# EasyEDA Pro project DA15.epro, schematic DA15

## Sheets
1 Controller: Board Name: DA15_H5_4_LAYERS; Create Date: 2026-02-15; Page Name: Controller; Project Name: dac-amp; Schematic Name: DA15_2; Update Date: 2026-02-26; Company: EasyEDA.com; Page Size: A4; Version: V1.0
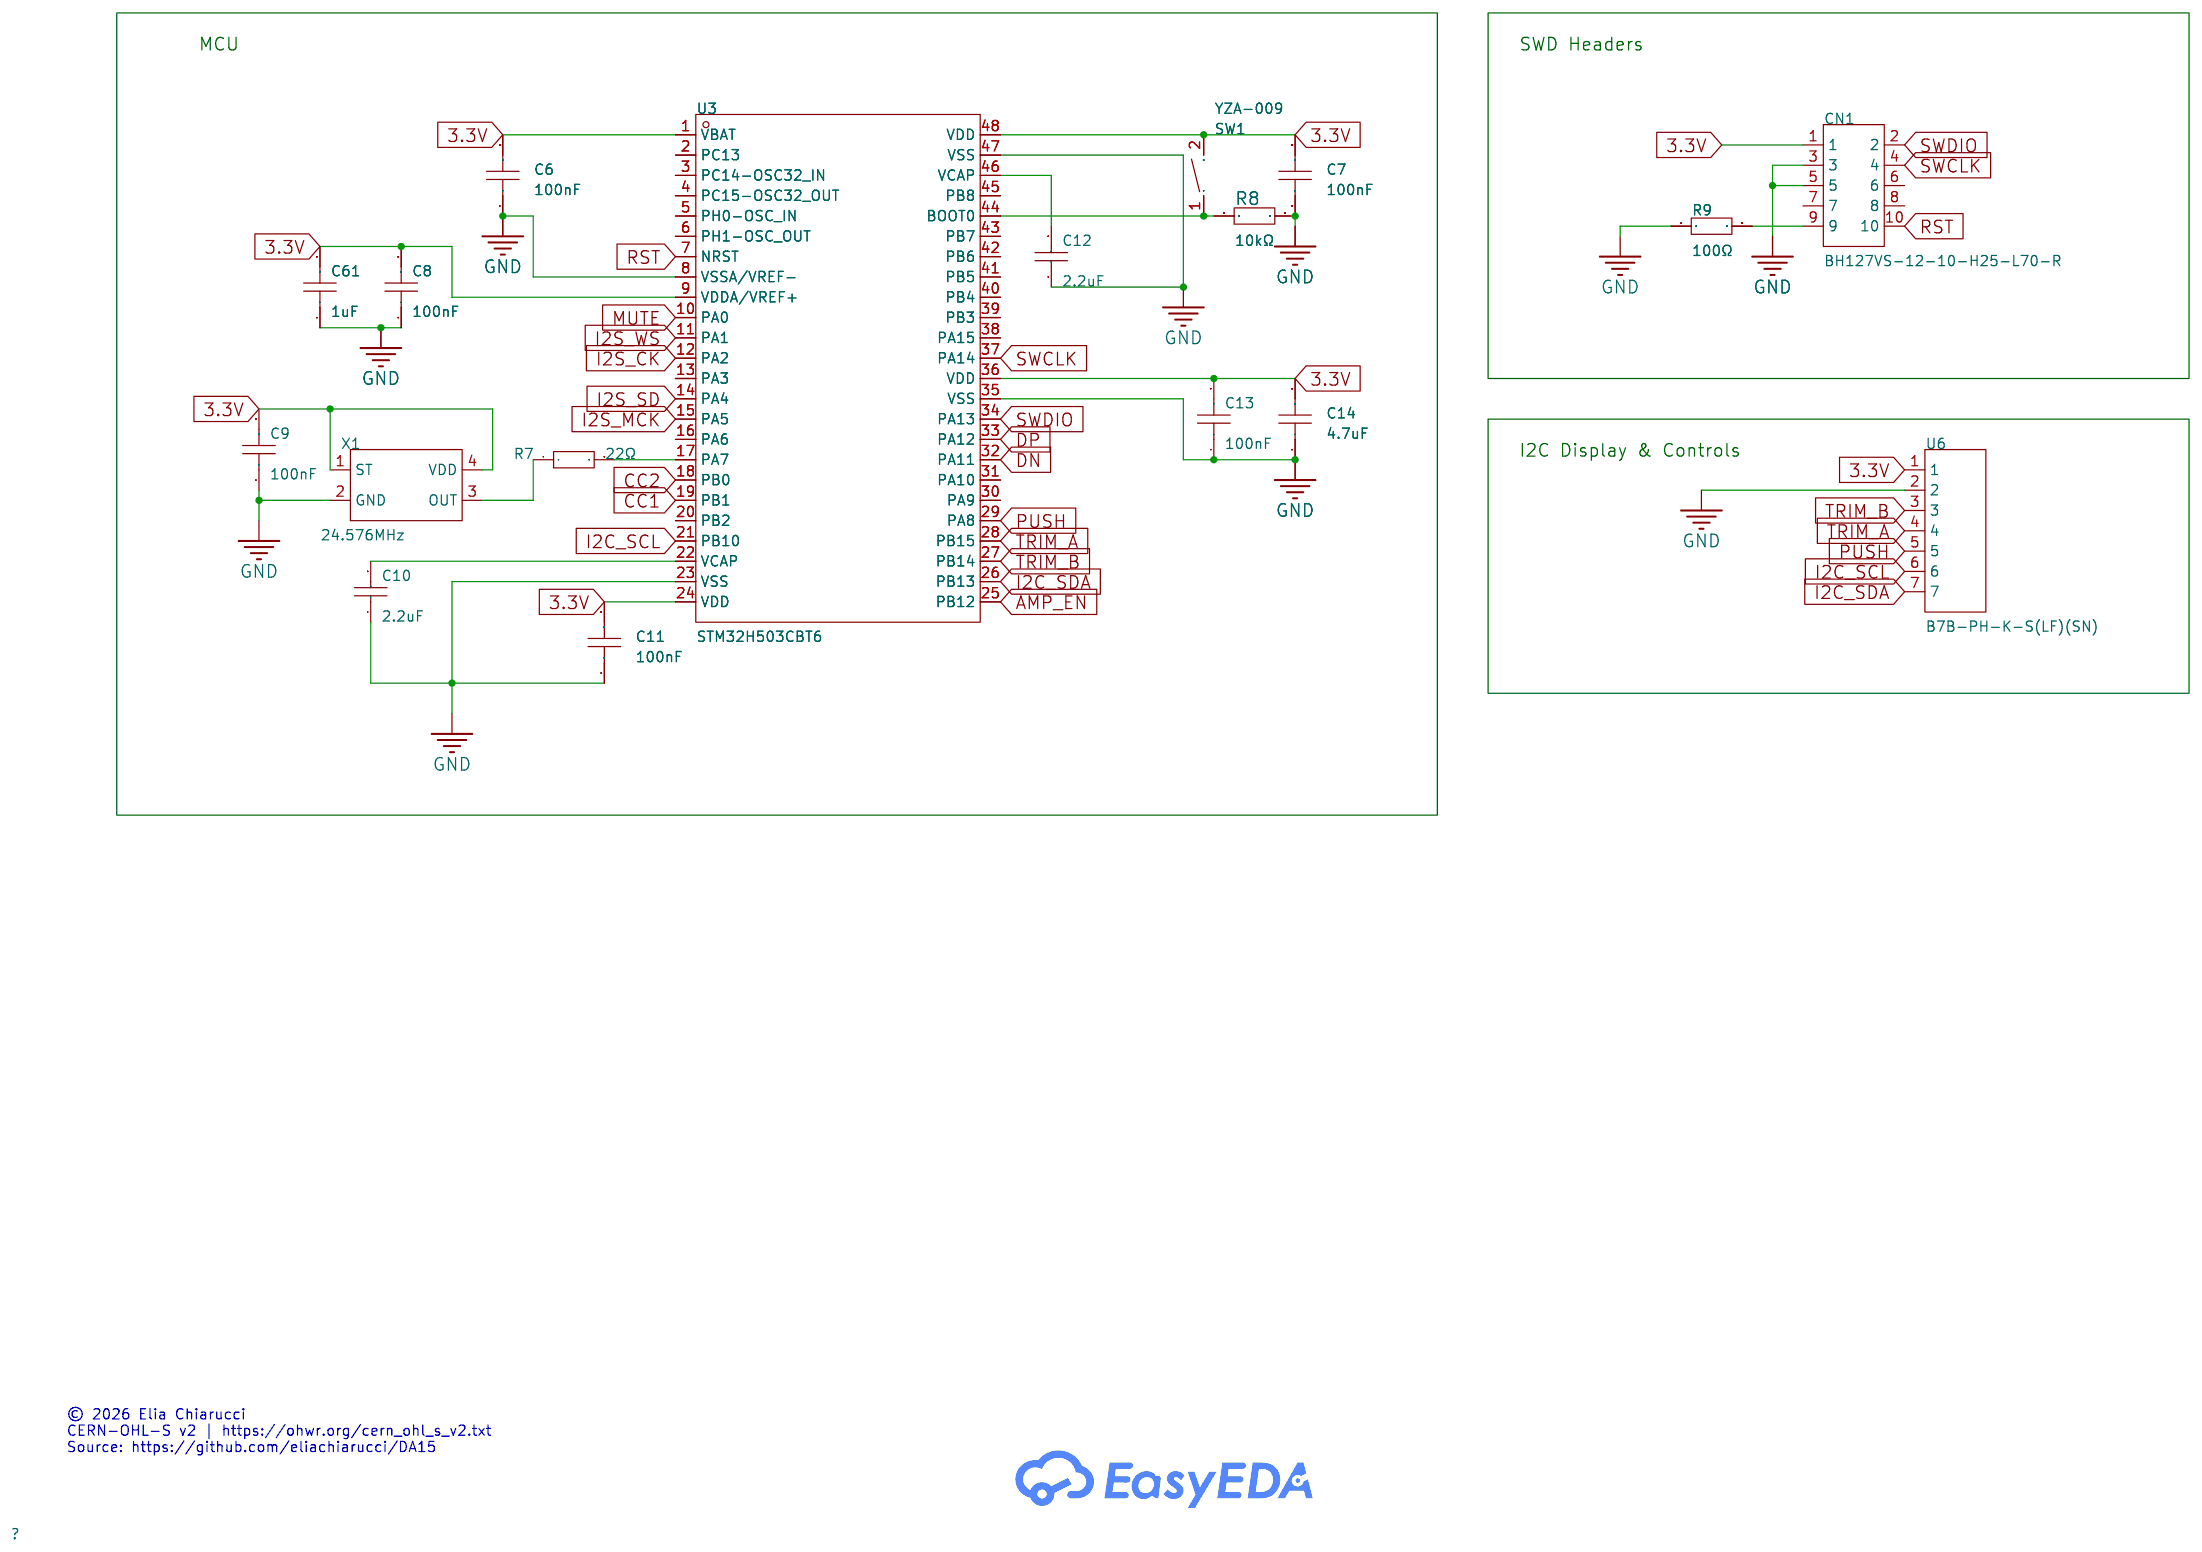
[diagram p0: Controller]
2 Power: Board Name: DA15_1; Create Date: 2026-02-10; Page Name: Power; Schematic Name: DA15_1; Update Date: 2026-02-11
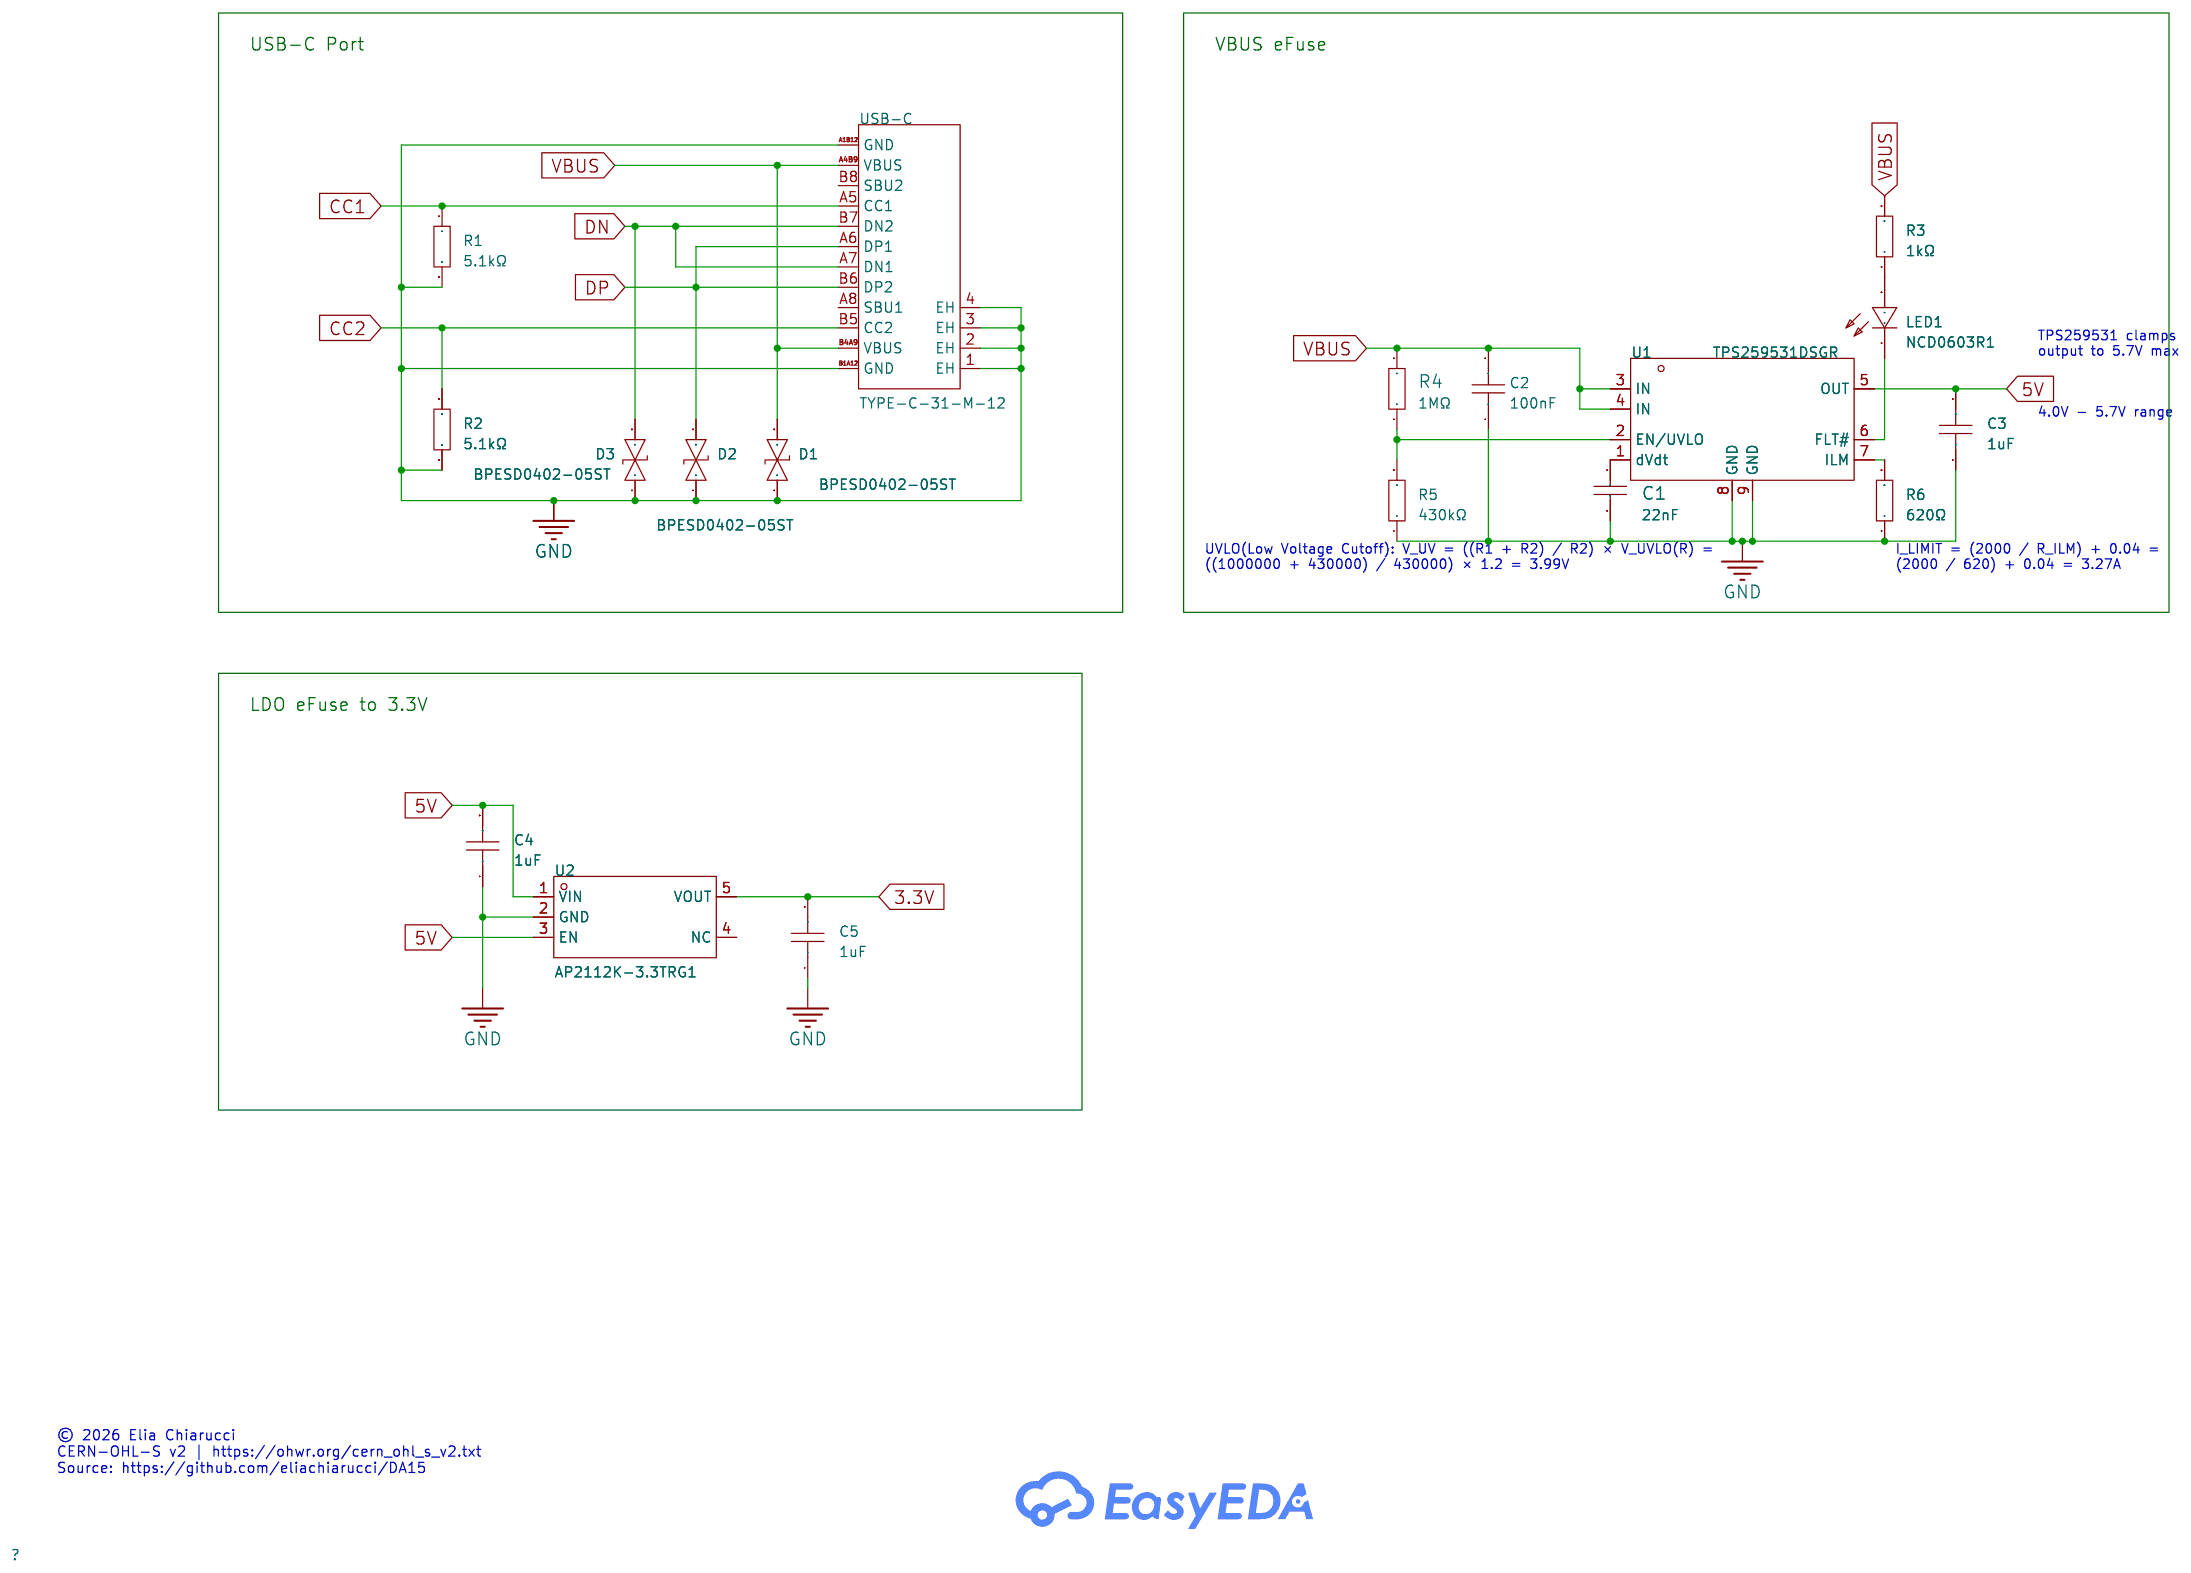
[diagram p1: Power]
3 Audio: Page Name: Audio
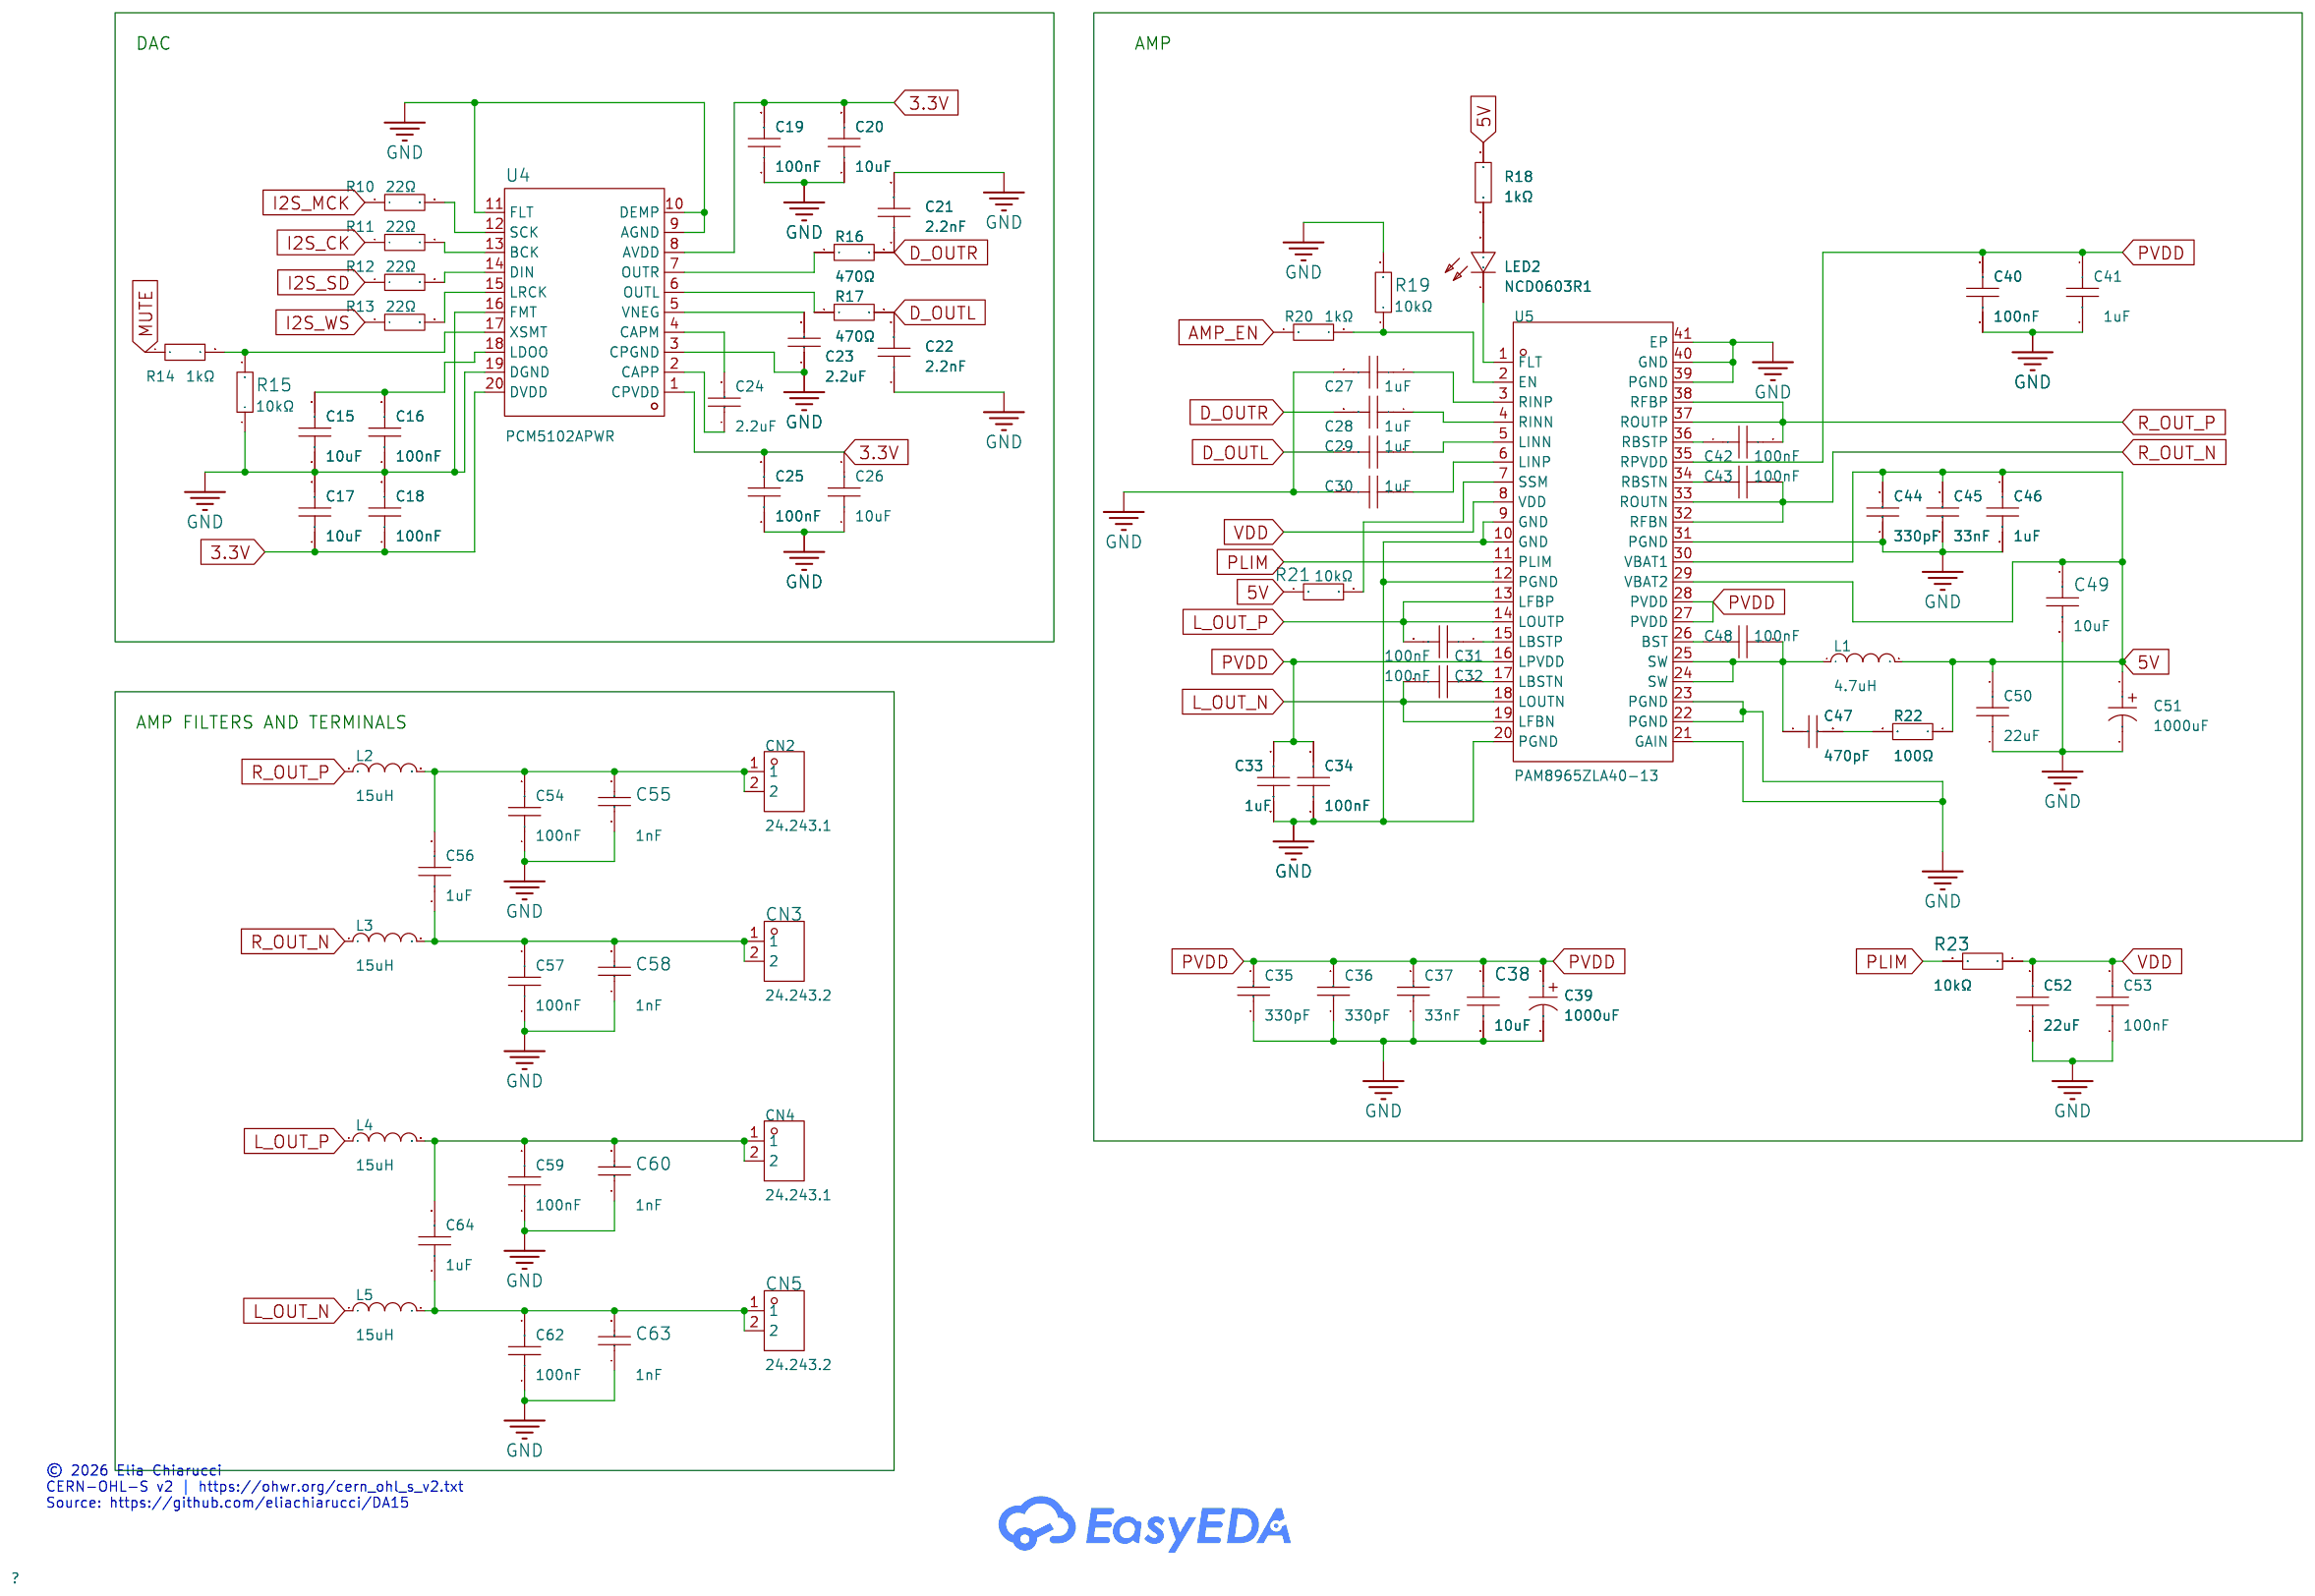
[diagram p2: Audio]

## Parts
sheet Audio
C15  10uF  [C0603]
C16  100nF  [C0603]
C17  10uF  [C0603]
C18  100nF  [C0603]
C19  100nF  [C0603]
C20  10uF  [C0603]
C21  2.2nF  [C0603]
C22  2.2nF  [C0603]
C23  2.2uF  [C0603]
C24  2.2uF  [C0603]
C25  100nF  [C0603]
C26  10uF  [C0603]
C27  1uF  [C0603]
C28  1uF  [C0603]
C29  1uF  [C0603]
C30  1uF  [C0603]
C31  100nF  [C0603]
C32  100nF  [C0603]
C33  1uF  [C0603]
C34  100nF  [C0603]
C35  330pF  [C0603]
C36  330pF  [C0603]
C37  33nF  [C0603]
C38  10uF  [C0603]
C39  1000uF  [CAP-TH_BD8.0-P3.50-D0.6-FD]
C40  100nF  [C0603]
C41  1uF  [C0603]
C42  100nF  [C0603]
C43  100nF  [C0603]
C44  330pF  [C0603]
C45  33nF  [C0603]
C46  1uF  [C0603]
C47  470pF  [C0603]
C48  100nF  [C0603]
C49  10uF  [C0603]
C50  22uF  [C0603]
C51  1000uF  [CAP-TH_BD8.0-P3.50-D0.6-FD]
C52  22uF  [C0603]
C53  100nF  [C0603]
C54  100nF  [C0603]
C55  1nF  [C0603]
C56  1uF  [C0603]
C57  100nF  [C0603]
C58  1nF  [C0603]
C59  100nF  [C0603]
C60  1nF  [C0603]
C62  100nF  [C0603]
C63  1nF  [C0603]
C64  1uF  [C0603]
CN2  24.243.1  [CONN-TH_24.243.1_RED]
CN3  24.243.2  [CONN-TH_24.243.2]
CN4  24.243.1  [CONN-TH_24.243.1_RED]
CN5  24.243.2  [CONN-TH_24.243.2]
L1  4.7uH  [IND-SMD_L7.3-W6.6_MHCI06030]
L2  15uH  [IND-SMD_L11.6-W10.1]
L3  15uH  [IND-SMD_L11.6-W10.1]
L4  15uH  [IND-SMD_L11.6-W10.1]
L5  15uH  [IND-SMD_L11.6-W10.1]
LED2  NCD0603R1  [LED0603-RD_RED]
R10  22Ω  [R0603]
R11  22Ω  [R0603]
R12  22Ω  [R0603]
R13  22Ω  [R0603]
R14  1kΩ  [R0603]
R15  10kΩ  [R0603]
R16  470Ω  [R0603]
R17  470Ω  [R0603]
R18  1kΩ  [R0603]
R19  10kΩ  [R0603]
R20  1kΩ  [R0603]
R21  10kΩ  [R0603]
R22  100Ω  [R0603]
R23  10kΩ  [R0603]
U4  PCM5102APWR  [TSSOP-20_L6.5-W4.4-P0.65-LS6.4-BL]
U5  PAM8965ZLA40-13  [WQFN-40_L5.0-W5.0-P0.40-TL-EP3.5]
sheet Controller
C6  100nF  [C0603]
C7  100nF  [C0603]
C8  100nF  [C0603]
C9  100nF  [C0603]
C10  2.2uF  [C0603]
C11  100nF  [C0603]
C12  2.2uF  [C0603]
C13  100nF  [C0603]
C14  4.7uF  [C0603]
C61  1uF  [C0603]
CN1  BH127VS-12-10-H25-L70-R  [CONN-SMD_10P-P1.27-V-M-R2-C5-LS5.8_BH127VS-12-10-H25-L70-R]
R7  22Ω  [R0603]
R8  10kΩ  [R0603]
R9  100Ω  [R0603]
SW1  YZA-009  [SW-SMD_YZA-009]
U3  STM32H503CBT6  [LQFP-48_L7.0-W7.0-P0.50-LS9.0-BL]
U6  B7B-PH-K-S(LF)(SN)  [CONN-TH_B7B-PH-K-S-LF-SN]
X1  24.576MHz  [OSC-SMD_4P-L2.5-W2.0-BL]
sheet Power
C1  22nF  [C0603]
C2  100nF  [C0603]
C3  1uF  [C0603]
C4  1uF  [C0603]
C5  1uF  [C0603]
D1  BPESD0402-05ST  [D0402-BI]
D2  BPESD0402-05ST  [D0402-BI]
D3  BPESD0402-05ST  [D0402-BI]
LED1  NCD0603R1  [LED0603-RD_RED]
R1  5.1kΩ  [R0603]
R2  5.1kΩ  [R0603]
R3  1kΩ  [R0603]
R4  1MΩ  [R0603]
R5  430kΩ  [R0603]
R6  620Ω  [R0603]
U1  TPS259531DSGR  [WSON-8_L2.0-W2.0-P0.50-TL-EP]
U2  AP2112K-3.3TRG1  [SOT-25-5_L2.9-W1.6-P0.95-LS2.8-BL]
USB-C  TYPE-C-31-M-12  [USB-C_SMD-TYPE-C-31-M-12_1]

## Library data of the parts
C15 C17 C20 C26 = CL10A106KP8NNNC: Capacitance:10uF Tolerance:±10% Tolerance:±10% Voltage Rating:10V Temperature Coefficient:X5R; LCSC Part Name: 10uF ±10% 10V; Supplier Part: C19702; Manufacturer: SAMSUNG(三星); Supplier Footprint: 0603; JLCPCB Part Class: Basic Part; Datasheet: https://item.szlcsc.com/datasheet/CL10A106KP8NNNC/20411.html; Supplier: LCSC; Tolerance: ±10%; Voltage Rating: 10V; Temperature Coefficient: X5R
C2 C6-C9 C11 C13 C16 C18 C19 C25 C31 C32 C34 C40 C42 C43 C48 C53 C54 C57 C59 C62 = CC0603KRX7R9BB104: Capacitance:100nF Tolerance:±10% Tolerance:±10% Voltage Rating:50V Temperature Coefficient:X7R; LCSC Part Name: 100nF ±10% 50V; Supplier Part: C14663; Manufacturer: YAGEO(国巨); Supplier Footprint: 0603; JLCPCB Part Class: Basic Part; Datasheet: https://item.szlcsc.com/datasheet/CC0603KRX7R9BB104/15331.html; Supplier: LCSC; Tolerance: ±10%; Voltage Rating: 50V; Temperature Coefficient: X7R
C21 C22 = GCM1885C1H222FA16D: Capacitance: Tolerance:±1% Tolerance:±1% Voltage Rated:50V Temperature Coefficient:; LCSC Part Name: 2.2nF ±1% 50V; Supplier Part: C882578; Manufacturer: muRata(村田); Supplier Footprint: 0603; JLCPCB Part Class: Extended Part; Datasheet: https://atta.szlcsc.com/upload/public/pdf/source/20201228/C882578_EDF992AD6064A2D085B371C371799E69.pdf; Supplier: LCSC; Tolerance: ±1%; Voltage Rated: 50V
C10 C12 C23 C24 = CL10A225KO8NNNC: Capacitance:2.2uF Tolerance:±10% Tolerance:±10% Voltage Rating:16V Temperature Coefficient:X5R; LCSC Part Name: 2.2uF ±10% 16V; Supplier Part: C23630; Manufacturer: SAMSUNG(三星); Supplier Footprint: 0603; JLCPCB Part Class: Basic Part; Datasheet: https://item.szlcsc.com/datasheet/CL10A225KO8NNNC/24366.html; Supplier: LCSC; Tolerance: ±10%; Voltage Rating: 16V; Temperature Coefficient: X5R
C3-C5 C27-C30 C33 C41 C46 C56 C61 C64 = CL10A105KB8NNNC: Capacitance:1uF Tolerance:±10% Tolerance:±10% Voltage Rating:50V Temperature Coefficient:X5R; LCSC Part Name: 1uF ±10% 50V; Supplier Part: C15849; Manufacturer: SAMSUNG(三星); Supplier Footprint: 0603; JLCPCB Part Class: Basic Part; Datasheet: https://item.szlcsc.com/datasheet/CL10A105KB8NNNC/16531.html; Supplier: LCSC; Tolerance: ±10%; Voltage Rating: 50V; Temperature Coefficient: X5R
C35 C36 C44 = CL10C331JB8NNNC: Capacitance:330pF Tolerance:±5% Tolerance:±5% Voltage Rating:50V Temperature Coefficient:C0G; LCSC Part Name: 330pF ±5% 50V; Supplier Part: C1664; Manufacturer: SAMSUNG(三星); Supplier Footprint: 0603; JLCPCB Part Class: Basic Part; Datasheet: https://item.szlcsc.com/datasheet/CL10C331JB8NNNC/2016.html; Supplier: LCSC; Tolerance: ±5%; Voltage Rating: 50V; Temperature Coefficient: C0G
C37 C45 = CL10B333KB8NNNC: Capacitance:33nF Tolerance:±10% Tolerance:±10% Voltage Rating:50V Temperature Coefficient:X7R; LCSC Part Name: 33nF ±10% 50V; Supplier Part: C21117; Manufacturer: SAMSUNG(三星); Supplier Footprint: 0603; JLCPCB Part Class: Basic Part; Datasheet: https://item.szlcsc.com/datasheet/CL10B333KB8NNNC/21829.html; Supplier: LCSC; Tolerance: ±10%; Voltage Rating: 50V; Temperature Coefficient: X7R
C38 C49 = GRM188R61E106KA73D: Capacitance:10uF Tolerance:±10% Tolerance:±10% Voltage Rating:25V Temperature Coefficient:X5R; LCSC Part Name: 10uF ±10% 25V; Supplier Part: C344022; Manufacturer: muRata(村田); Supplier Footprint: 0603; JLCPCB Part Class: Extended Part; Datasheet: https://item.szlcsc.com/datasheet/GRM188R61E106KA73D/320824.html; Supplier: LCSC; Tolerance: ±10%; Voltage Rating: 25V; Temperature Coefficient: X5R
C39 C51 = PA25V1000M8X15: Capacitance:1000uF Tolerance:±20% Tolerance:±20% Voltage Rating:25V Ripple Current:4.1A@100kHz Equivalent Series Resistance(ESR):16mΩ@100kHz Type:Polymer Diameter:8mm Height - Seated (Max):15mm Lifetime:2000hrs@105℃ Operating Temperature:-55℃~+105℃ Operat; LCSC Part Name: 1000uF ±20% 25V; Supplier Part: C48935375; Manufacturer: JIERR(捷而瑞); Supplier Footprint: 插件,D8xL15mm; JLCPCB Part Class: Extended Part; Datasheet: https://item.szlcsc.com/datasheet/PA25V1000M8X15/51248495.html; Supplier: LCSC; Tolerance: ±20%; Voltage Rating: 25V; Ripple Current: 4.1A@100kHz; Equivalent Series Resistance(ESR): 16mΩ@100kHz; Type: Polymer; Diameter: 8mm; Height - Seated (Max): 15mm; Lifetime: 2000hrs@105℃; Operating Temperature: -55℃~+105℃
C47 = 0603B471K500NT: Capacitance:470pF Tolerance:±10% Tolerance:±10% Voltage Rating:50V Temperature Coefficient:X7R; LCSC Part Name: 470pF ±10% 50V; Supplier Part: C1620; Manufacturer: FH(风华); Supplier Footprint: 0603; JLCPCB Part Class: Basic Part; Datasheet: https://item.szlcsc.com/datasheet/0603B471K500NT/1972.html; Supplier: LCSC; Tolerance: ±10%; Voltage Rating: 50V; Temperature Coefficient: X7R
C50 C52 = GRM188C61E226ME01D: Capacitance:22uF Tolerance:±20% Tolerance:±20% Voltage Rating:25V; LCSC Part Name: 22uF ±20% 25V; Supplier Part: C29519229; Manufacturer: muRata(村田); Supplier Footprint: 0603; JLCPCB Part Class: Extended Part; Datasheet: https://item.szlcsc.com/datasheet/GRM188C61E226ME01D/31245821.html; Supplier: LCSC; Tolerance: ±20%; Voltage Rating: 25V
C55 C58 C60 C63 = CL10B102KB8NNNC: Capacitance:1nF Tolerance:±10% Tolerance:±10% Voltage Rating:50V Temperature Coefficient:X7R; LCSC Part Name: 1nF ±10% 50V; Supplier Part: C1588; Manufacturer: SAMSUNG(三星); Supplier Footprint: 0603; JLCPCB Part Class: Basic Part; Datasheet: https://item.szlcsc.com/datasheet/CL10B102KB8NNNC/1940.html; Supplier: LCSC; Tolerance: ±10%; Voltage Rating: 50V; Temperature Coefficient: X7R
CN2 CN4 = 24.243.1: Connector Type:Terminal Voltage Rating:60V Current Rating:24A; LCSC Part Name: 接线柱; Supplier Part: C7437321; Manufacturer: AMASS(艾迈斯); Supplier Footprint: 插件; JLCPCB Part Class: Extended Part; Datasheet: https://item.szlcsc.com/datasheet/24.243.1/8459546.html; Supplier: LCSC; Connector Type: Terminal; Voltage Rating: 60V; Current Rating: 24A
CN3 CN5 = 24.243.2: Connector Type:Terminal Voltage Rating:60V Current Rating:24A; LCSC Part Name: 接线柱; Supplier Part: C7437322; Manufacturer: AMASS(艾迈斯); Supplier Footprint: 插件; JLCPCB Part Class: Extended Part; Datasheet: https://item.szlcsc.com/datasheet/24.243.2/8459547.html; Supplier: LCSC; Connector Type: Terminal; Voltage Rating: 60V; Current Rating: 24A
L1 = SRP7028A-4R7M: Inductance:4.7uH Tolerance:±20% Tolerance:±20% Current Rating:5.5A Current - Saturation(Isat):10A DC Resistance(DCR):37mΩ Type:- Ratings:AEC-Q200; LCSC Part Name: 4.7uH ±20% 10A; Supplier Part: C840529; Manufacturer: BOURNS; Supplier Footprint: SMD,7.3x6.6mm; JLCPCB Part Class: Extended Part; Datasheet: https://item.szlcsc.com/datasheet/SRP7028A-4R7M/897031.html; Supplier: LCSC; Tolerance: ±20%; Current Rating: 5.5A; Current - Saturation(Isat): 10A; DC Resistance(DCR): 37mΩ; Ratings: AEC-Q200
L2-L5 = CYA1040-15UH: Inductance: Tolerance:±20% Tolerance:±20% Rated Current:6.25A Saturation Current (Isat): DC Resistance (DCR):; LCSC Part Name: 15uH ±20% 6A; Supplier Part: C6364678; Manufacturer: SHOU HAN(首韩); Supplier Footprint: SMD,11.6x10.1mm; JLCPCB Part Class: Extended Part; Datasheet: https://atta.szlcsc.com/upload/public/pdf/source/20230523/79E0199319BE6C9C9D22935DF2949D18.pdf; Supplier: LCSC; Tolerance: ±20%; Rated Current: 6.25A
LED1 LED2 = NCD0603R1_C84263: Lamp Holder Type:- Illumination Color:Red Voltage - Forward(Vf):1.6V~2.6V Voltage - Forward(Vf):1.6V~2.6V Power(Watts):65mW Forward Current:25mA Wavelength - Dominant:615nm~630nm Wavelength - Dominant:615nm~630nm Peak Wavelength:630nm Diode Configuration:; LCSC Part Name: 片式发光二极管; Supplier Part: C84263; Manufacturer: 国星光电; Supplier Footprint: 0603; JLCPCB Part Class: Extended Part; Datasheet: https://item.szlcsc.com/datasheet/NCD0603R1/85432.html; Supplier: LCSC; Illumination Color: Red; Voltage - Forward(Vf): 1.6V~2.6V; Power(Watts): 65mW; Forward Current: 25mA; Wavelength - Dominant: 615nm~630nm; Peak Wavelength: 630nm; Diode Configuration: Discrete Diode; Luminous Intensity: 220mcd; Viewing Angle: 130°; Operating Temperature: -30℃~+85℃
R7 R10-R13 = 0603WAF220JT5E: Type:Thick Film Resistors Resistance:22Ω Tolerance:±1% Tolerance:±1% Power(Watts): Overload Voltage (Max): Temperature Coefficient:±100ppm/℃ Temperature Coefficient:±100ppm/℃ Operating Temperature Range:-55℃~+155℃ Operating Temperature Range:-55℃~+155℃; LCSC Part Name: 22Ω ±1% 100mW 厚膜电阻; Supplier Part: C23345; Manufacturer: UNI-ROYAL(厚声); Supplier Footprint: 0603; JLCPCB Part Class: Basic Part; Datasheet: https://atta.szlcsc.com/upload/public/pdf/source/20200306/C422600_1E6D84923E4A46A82E41ADD87F860B5C.pdf; Supplier: LCSC; Type: Thick Film Resistors; Tolerance: ±1%; Temperature Coefficient: ±100ppm/℃; Operating Temperature Range: -55℃~+155℃
R3 R14 R18 R20 = 0603WAF1001T5E: Type:Thick Film Resistor Resistance:1kΩ Tolerance:±1% Tolerance:±1% Power(Watts):100mW Voltage-Supply(Max):75V Temperature Coefficient:±100ppm/℃ Temperature Coefficient:±100ppm/℃ Operating Temperature:-55℃~+155℃ Operating Temperature:-55℃~+155℃; LCSC Part Name: 1kΩ ±1% 100mW 厚膜电阻; Supplier Part: C21190; Manufacturer: UNI-ROYAL(厚声); Supplier Footprint: 0603; JLCPCB Part Class: Basic Part; Datasheet: https://item.szlcsc.com/datasheet/0603WAF1001T5E/21904.html; Supplier: LCSC; Type: Thick Film Resistor; Tolerance: ±1%; Power(Watts): 100mW; Voltage-Supply(Max): 75V; Temperature Coefficient: ±100ppm/℃; Operating Temperature: -55℃~+155℃
R8 R15 R19 R21 R23 = 0603WAF1002T5E: Type:Thick Film Resistor Resistance:10kΩ Tolerance:±1% Tolerance:±1% Power(Watts):100mW Voltage-Supply(Max):75V Temperature Coefficient:±100ppm/℃ Temperature Coefficient:±100ppm/℃ Operating Temperature:-55℃~+155℃ Operating Temperature:-55℃~+155℃; LCSC Part Name: 厚膜电阻 10kΩ ±1% 100mW; Supplier Part: C25804; Manufacturer: UNI-ROYAL(厚声); Supplier Footprint: 0603; JLCPCB Part Class: Basic Part; Datasheet: https://item.szlcsc.com/datasheet/0603WAF1002T5E/26547.html; Supplier: LCSC; Type: Thick Film Resistor; Tolerance: ±1%; Power(Watts): 100mW; Voltage-Supply(Max): 75V; Temperature Coefficient: ±100ppm/℃; Operating Temperature: -55℃~+155℃
R16 R17 = 0603WAF4700T5E: Type:Thick Film Resistor Resistance:470Ω Tolerance:±1% Tolerance:±1% Power(Watts):100mW Voltage-Supply(Max):75V Temperature Coefficient:±100ppm/℃ Temperature Coefficient:±100ppm/℃ Operating Temperature:-55℃~+155℃ Operating Temperature:-55℃~+155℃; LCSC Part Name: 470Ω ±1% 100mW 厚膜电阻; Supplier Part: C23179; Manufacturer: UNI-ROYAL(厚声); Supplier Footprint: 0603; JLCPCB Part Class: Basic Part; Datasheet: https://item.szlcsc.com/datasheet/0603WAF4700T5E/23906.html; Supplier: LCSC; Type: Thick Film Resistor; Tolerance: ±1%; Power(Watts): 100mW; Voltage-Supply(Max): 75V; Temperature Coefficient: ±100ppm/℃; Operating Temperature: -55℃~+155℃
R9 R22 = 0603WAF1000T5E: Type:Thick Film Resistors Resistance: Tolerance:±1% Tolerance:±1% Power(Watts): Overload Voltage (Max): Temperature Coefficient:±200ppm/℃ Temperature Coefficient:±200ppm/℃ Operating Temperature Range:-55℃~+155℃ Operating Temperature Range:-55℃~+155℃; LCSC Part Name: 100Ω ±1% 100mW 厚膜电阻; Supplier Part: C22775; Manufacturer: UNI-ROYAL(厚声); Supplier Footprint: 0603; JLCPCB Part Class: Basic Part; Datasheet: https://atta.szlcsc.com/upload/public/pdf/source/20200306/C422600_1E6D84923E4A46A82E41ADD87F860B5C.pdf; Supplier: LCSC; Type: Thick Film Resistors; Tolerance: ±1%; Temperature Coefficient: ±200ppm/℃; Operating Temperature Range: -55℃~+155℃
U4 = PCM5102APWR: Interface Type:PCM Supply Voltage:1.65V~3.46V Supply Voltage:1.65V~3.46V Number of Channels:2 Resolution:24；16；32 Operating Temperature:-25℃~+85℃ Operating Temperature:-25℃~+85℃; Supplier Part: C107671; Manufacturer: TI(德州仪器); Supplier Footprint: TSSOP-20; JLCPCB Part Class: Extended Part; Datasheet: https://www.ti.com/cn/lit/gpn/pcm5102a; Supplier: LCSC; Interface Type: PCM; Supply Voltage: 1.65V~3.46V; Number of Channels: 2; Resolution: 24；16；32; Operating Temperature: -25℃~+85℃
U5 = PAM8965ZLA40-13: Class:Class D Speaker Channels:2-Channel Output Power:12Wx2@4Ω Voltage - Supply:2.8V~8.5V Voltage - Supply:2.8V~8.5V Total Harmonic Distortion + Noise (THD+N):0.035% Quiescent Current:10mA Operating Temperature:-40℃~+85℃ Operating Temperature:-40℃~+85℃ Si; Supplier Part: C5246121; Manufacturer: DIODES(美台); Supplier Footprint: WQFN-40(5x5); JLCPCB Part Class: Extended Part; Datasheet: https://item.szlcsc.com/datasheet/PAM8965ZLA40-13/5955732.html; Supplier: LCSC; Class: Class D; Speaker Channels: 2-Channel; Output Power: 12Wx2@4Ω; Voltage - Supply: 2.8V~8.5V; Total Harmonic Distortion + Noise (THD+N): 0.035%; Quiescent Current: 10mA; Operating Temperature: -40℃~+85℃; Signal-to-Noise Ratio: 100dB; Input Type: Differential；Single-Ended; Power Supply Rejection Ratio (PSRR): -67dB；-79dB; Efficiency: 92%; Number of Inputs: 2 Pairs Differential Inputs
C14 = CL10A475KO8NNNC: Capacitance:4.7uF Tolerance:±10% Tolerance:±10% Voltage Rating:16V Temperature Coefficient:X5R; LCSC Part Name: 4.7uF ±10% 16V; Supplier Part: C19666; Manufacturer: SAMSUNG(三星); Supplier Footprint: 0603; JLCPCB Part Class: Basic Part; Datasheet: https://item.szlcsc.com/datasheet/CL10A475KO8NNNC/20375.html; Supplier: LCSC; Tolerance: ±10%; Voltage Rating: 16V; Temperature Coefficient: X5R
CN1 = BH127VS-12-10-H25-L70-R: Pitch:1.27mm Number of Positions or Pins:2x5P Current Rating:1A Holder Type:Surface Mount,Vertical Number of Rows:2 Number of PINs Per Row:5 Contact Material:Brass Contact Plating:Gold Operating Temperature:-40℃~+105℃ Operating Temperature:-40℃~+105℃ Colo; LCSC Part Name: 1.27mm 2x5P 排数:2 每排P数:5; Supplier Part: C46971078; Manufacturer: XFCN(兴飞); Supplier Footprint: SMD,P=1.27mm; JLCPCB Part Class: Extended Part; Datasheet: https://item.szlcsc.com/datasheet/BH127VS-12-10-H25-L70-R/49149235.html; Supplier: LCSC; Pitch: 1.27mm; Number of Positions or Pins: 2x5P; Current Rating: 1A; Holder Type: Surface Mount,Vertical; Number of Rows: 2; Number of PINs Per Row: 5; Contact Material: Brass; Contact Plating: Gold; Operating Temperature: -40℃~+105℃; Color: Black
SW1 = YZA-009: PressForce:250±50gf Switch Size:3*4*2.0MM Installation Method:Front-Press RatedCurrent:50mA ButtonShape:Rectangle button WorkingLife:100,000 Cycles Circuit:SPST Type:Tactile Switch; LCSC Part Name: YIZHI(逸致) YZA-009 3*4*2.0MM 2脚贴片小龟正按轻触开关; Supplier Part: C49108621; Manufacturer: YIZHI(逸致); JLCPCB Part Class: Extended Part; Datasheet: https://item.szlcsc.com/datasheet/YZA-009/51487238.html; Supplier: LCSC; PressForce: 250±50gf; Switch Size: 3*4*2.0MM; Installation Method: Front-Press; RatedCurrent: 50mA; ButtonShape: Rectangle button; WorkingLife: 100,000 Cycles; Circuit: SPST; Type: Tactile Switch
U3 = STM32H503CBT6: LCSC Part Name: Arm Cortex-M33 32位MCU+FPU，375 DMIPS，250 MHz，128 Kbytes闪存，32 Kbytes RAM，I3C; Supplier Part: C17700273; Manufacturer: ST(意法半导体); Supplier Footprint: LQFP-48(7x7); JLCPCB Part Class: Extended Part; Datasheet: https://item.szlcsc.com/datasheet/STM32H503CBT6/18830536.html; Supplier: LCSC
U6 = B7B-PH-K-S(LF)(SN): Pins Structure:1x7P Pitch:2mm Mounting Type:Through Hole Reference Series:PH Number of Pins:7P Number of Rows:1 Number of PINs Per Row:7 Row Spacing:- Current Rating:2A Contact Material:Brass Contact Plating:Tin Operating Temperature:-25℃~+85℃ Operating T; LCSC Part Name: 1x7P 间距:2mm 直插 系列:PH; Supplier Part: C157981; Manufacturer: JST; Supplier Footprint: 插件,P=2mm; JLCPCB Part Class: Extended Part; Datasheet: https://item.szlcsc.com/datasheet/B7B-PH-K-S(LF)(SN)/169329.html; Supplier: LCSC; Pins Structure: 1x7P; Pitch: 2mm; Mounting Type: Through Hole; Reference Series: PH; Number of Pins: 7P; Number of Rows: 1; Number of PINs Per Row: 7; Current Rating: 2A; Contact Material: Brass; Contact Plating: Tin; Operating Temperature: -25℃~+85℃; Voltage Rating: 100V; Plastic Material: PA66; Flame Retardant Rating: UL94V-0; Supplementary Features: K Pin; Color: White; Z-Height of the Board: 6mm; X-Length of Bottom Edge on Board (Spacing Line): 15.9mm; Y-Width of Bottom Edge on Board: 4.5mm
X1 = OT3EL4C4JI-111OLP-24.576M: Frequency:24.576MHz Normal temperature Frequency Tolerance:±10ppm Normal temperature Frequency Tolerance:±10ppm Output Type:CMOS Voltage - Supply:1.8V~3.3V Voltage - Supply:1.8V~3.3V Frequency Stability:±20ppm Frequency Stability:±20ppm Operating Temperat; LCSC Part Name: YSO110TR 24.576MHZ 1.8V-3.3V ±10PPM -40~85℃（±20PPM) CMOS; Supplier Part: C5203564; Manufacturer: YXC(扬兴晶振); Supplier Footprint: SMD2520-4P; JLCPCB Part Class: Extended Part; Datasheet: https://item.szlcsc.com/datasheet/OT3EL4C4JI-111OLP-24.576M/5892926.html; Supplier: LCSC; Normal temperature Frequency Tolerance: ±10ppm; Output Type: CMOS; Voltage - Supply: 1.8V~3.3V; Frequency Stability: ±20ppm; Operating Temperature: -40℃~+85℃
C1 = CL10B223KB8NNNC: Capacitance:22nF Tolerance:±10% Tolerance:±10% Voltage Rating:50V Temperature Coefficient:X7R; LCSC Part Name: 22nF ±10% 50V; Supplier Part: C21122; Manufacturer: SAMSUNG(三星); Supplier Footprint: 0603; JLCPCB Part Class: Basic Part; Datasheet: https://item.szlcsc.com/datasheet/CL10B223KB8NNNC/21834.html; Supplier: LCSC; Tolerance: ±10%; Voltage Rating: 50V; Temperature Coefficient: X7R
D1-D3 = BPESD0402-05ST: Polarity:Bidirectional Reverse Stand-Off Voltage (Vrwm):5V Clamping Voltage:40V Reverse Leakage Current (Ir):10nA Number of Channels:1 level of protection:IEC 61000-4-2 Type:ESD Junction Capacitance:0.05pF; LCSC Part Name: 双向ESD 5V截止; Supplier Part: C316059; Manufacturer: BORN(伯恩半导体); Supplier Footprint: 0402; JLCPCB Part Class: Extended Part; Datasheet: https://item.szlcsc.com/datasheet/BPESD0402-05ST/297747.html; Supplier: LCSC; Polarity: Bidirectional; Reverse Stand-Off Voltage (Vrwm): 5V; Clamping Voltage: 40V; Reverse Leakage Current (Ir): 10nA; Number of Channels: 1; level of protection: IEC 61000-4-2; Type: ESD; Junction Capacitance: 0.05pF
R1 R2 = 0603WAF5101T5E: Type:Thick Film Resistor Resistance:5.1kΩ Tolerance:±1% Tolerance:±1% Power(Watts):100mW Voltage-Supply(Max):75V Temperature Coefficient:±100ppm/℃ Temperature Coefficient:±100ppm/℃ Operating Temperature:-55℃~+155℃ Operating Temperature:-55℃~+155℃; LCSC Part Name: 5.1kΩ ±1% 100mW 厚膜电阻; Supplier Part: C23186; Manufacturer: UNI-ROYAL(厚声); Supplier Footprint: 0603; JLCPCB Part Class: Basic Part; Datasheet: https://item.szlcsc.com/datasheet/0603WAF5101T5E/23913.html; Supplier: LCSC; Type: Thick Film Resistor; Tolerance: ±1%; Power(Watts): 100mW; Voltage-Supply(Max): 75V; Temperature Coefficient: ±100ppm/℃; Operating Temperature: -55℃~+155℃
R4 = 0603WAF1004T5E: Type:Thick Film Resistors Resistance:1MΩ Tolerance:±1% Tolerance:±1% Power(Watts): Overload Voltage (Max): Temperature Coefficient:±100ppm/℃ Temperature Coefficient:±100ppm/℃ Operating Temperature Range:-55℃~+155℃ Operating Temperature Range:-55℃~+155℃; LCSC Part Name: 1MΩ ±1% 100mW 厚膜电阻; Supplier Part: C22935; Manufacturer: UNI-ROYAL(厚声); Supplier Footprint: 0603; JLCPCB Part Class: Basic Part; Datasheet: https://atta.szlcsc.com/upload/public/pdf/source/20200306/C422600_1E6D84923E4A46A82E41ADD87F860B5C.pdf; Supplier: LCSC; Type: Thick Film Resistors; Tolerance: ±1%; Temperature Coefficient: ±100ppm/℃; Operating Temperature Range: -55℃~+155℃
R5 = 0603WAF4303T5E: Type:Thick Film Resistor Resistance:430kΩ Tolerance:±1% Tolerance:±1% Power(Watts):100mW Voltage-Supply(Max):75V Temperature Coefficient:±100ppm/℃ Temperature Coefficient:±100ppm/℃ Operating Temperature:-55℃~+155℃ Operating Temperature:-55℃~+155℃; LCSC Part Name: 430kΩ ±1% 100mW 厚膜电阻; Supplier Part: C25969; Manufacturer: UNI-ROYAL(厚声); Supplier Footprint: 0603; JLCPCB Part Class: Extended Part; Datasheet: https://item.szlcsc.com/datasheet/0603WAF4303T5E/26712.html; Supplier: LCSC; Type: Thick Film Resistor; Tolerance: ±1%; Power(Watts): 100mW; Voltage-Supply(Max): 75V; Temperature Coefficient: ±100ppm/℃; Operating Temperature: -55℃~+155℃
R6 = 0603WAF6200T5E: Type:Thick Film Resistor Resistance:620Ω Tolerance:±1% Tolerance:±1% Power(Watts):100mW Voltage-Supply(Max):75V Temperature Coefficient:±100ppm/℃ Temperature Coefficient:±100ppm/℃ Operating Temperature:-55℃~+155℃ Operating Temperature:-55℃~+155℃; LCSC Part Name: 620Ω ±1% 100mW 厚膜电阻; Supplier Part: C23220; Manufacturer: UNI-ROYAL(厚声); Supplier Footprint: 0603; JLCPCB Part Class: Extended Part; Datasheet: https://item.szlcsc.com/datasheet/0603WAF6200T5E/23947.html; Supplier: LCSC; Type: Thick Film Resistor; Tolerance: ±1%; Power(Watts): 100mW; Voltage-Supply(Max): 75V; Temperature Coefficient: ±100ppm/℃; Operating Temperature: -55℃~+155℃
U1 = TPS259531DSGR: FET Type:Integrated FET Number of Lines:1 Voltage Rating:2.7V~18V Voltage Rating:2.7V~18V Mounting Type:Surface Mount RDS(on):34mΩ Operating temperature:-40℃~+125℃@(Tj) Operating temperature:-40℃~+125℃@(Tj) Length:2mm Width:2mm Height:0.75mm; LCSC Part Name: 2.7V至18V、4A、34mΩ电子保险丝，具有快速过压保护; Supplier Part: C2155674; Manufacturer: TI(德州仪器); Supplier Footprint: WSON-8-EP(2x2); JLCPCB Part Class: Extended Part; Datasheet: https://www.ti.com/cn/lit/gpn/tps2595; Supplier: LCSC; FET Type: Integrated FET; Number of Lines: 1; Voltage Rating: 2.7V~18V; Mounting Type: Surface Mount; RDS(on): 34mΩ; Operating temperature: -40℃~+125℃@(Tj); Length: 2mm; Width: 2mm; Height: 0.75mm
U2 = AP2112K-3.3TRG1: Output Type:Fixed Voltage - Supply:6V Output Voltage:3.3V Output Voltage:3.3V Output Current:600mA Power Supply Rejection Ratio (PSRR):65dB@(1kHz) Voltage Dropout:250mV@(600mA) standby current:55uA Noise:50uVrms Features:Enable；Over Temperature Protection; LCSC Part Name: 输入6V 输出3.3V 600mA; Supplier Part: C51118; Manufacturer: DIODES(美台); Supplier Footprint: SOT-25-5; JLCPCB Part Class: Extended Part; Datasheet: https://item.szlcsc.com/datasheet/AP2112K-3.3TRG1/52131.html; Supplier: LCSC; Output Type: Fixed; Voltage - Supply: 6V; Output Voltage: 3.3V; Output Current: 600mA; Power Supply Rejection Ratio (PSRR): 65dB@(1kHz); Voltage Dropout: 250mV@(600mA); standby current: 55uA; Noise: 50uVrms; Features: Enable；Over Temperature Protection；Over Current Protection; Operating Temperature: -40℃~+85℃@(Ta); Output Configuration: Positive; Number of Outputs: 1
USB-C = TYPE-C-31-M-12: Connector Type:Type-C Protocol Standard:- Gender:Female Mounting Type:Surface Mount, Right Angle Number of Contacts:16P Number of Ports:1 Current Rating-Power:5A Voltage Rating:20V Connect-Disconnect Life:10,000 cycles Length:7.35mm Operating Temperature:; LCSC Part Name: Type-C 母 卧贴; Supplier Part: C165948; Manufacturer: 韩国韩荣; Supplier Footprint: SMD; JLCPCB Part Class: Extended Part; Datasheet: https://item.szlcsc.com/datasheet/TYPE-C-31-M-12/177331.html; Supplier: LCSC; Connector Type: Type-C; Gender: Female; Mounting Type: Surface Mount, Right Angle; Number of Contacts: 16P; Number of Ports: 1; Current Rating-Power: 5A; Voltage Rating: 20V; Connect-Disconnect Life: 10,000 cycles; Length: 7.35mm; Operating Temperature: -30℃~+80℃

## Nets
3.3V: C5.2 C6.2 C7.2 C8.2 C9.2 C11.2 C13.2 C14.2 C17.1 C18.1 C19.2 C20.2 C25.2 C26.2 C61.2 CN1.1 SW1.2 U2.5(VOUT) U3.1(VBAT) U3.9(VDDA/VREF+) U3.24(VDD) U3.36(VDD) U3.48(VDD) U4.1(CPVDD) U4.8(AVDD) U4.20(DVDD) U6.1 X1.1(ST) X1.4(VDD)
5V: C3.2 C4.2 C44.2 C45.2 C46.1 C49.1 C50.2 C51.1 L1.2 R18.2 R21.1 R22.1 U1.5(OUT) U2.1(VIN) U2.3(EN) U5.29(VBAT2) U5.30(VBAT1)
GND: C1.2 C2.1 C3.1 C4.1 C5.1 C6.1 C7.1 C8.1 C9.1 C10.1 C11.1 C12.1 C13.1 C14.1 C15.1 C16.1 C17.2 C18.2 C19.1 C20.1 C21.2 C22.1 C23.1 C25.1 C26.1 C27.2 C30.2 C33.2 C34.1 C35.1 C36.1 C37.1 C38.2 C39.2 C40.1 C41.2 C44.1 C45.1 C46.2 C49.2 C50.1 C51.2 C52.1 C53.1 C54.1 C55.1 C57.1 C58.1 C59.1 C60.1 C61.1 C62.1 C63.1 CN1.3 CN1.5 D1.1 D2.1 D3.1 R1.2 R2.2 R5.1 R6.1 R8.2 R9.1 R15.1 R19.2 U1.8(GND) U1.9(GND) U2.2(GND) U3.8(VSSA/VREF-) U3.23(VSS) U3.35(VSS) U3.47(VSS) U4.3(CPGND) U4.9(AGND) U4.10(DEMP) U4.11(FLT) U4.16(FMT) U4.19(DGND) U5.9(GND) U5.10(GND) U5.12(PGND) U5.20(PGND) U5.21(GAIN) U5.22(PGND) U5.23(PGND) U5.31(PGND) U5.39(PGND) U5.40(GND) U5.41(EP) U6.2 USB-C.1(EH) USB-C.2(EH) USB-C.3(EH) USB-C.4(EH) USB-C.A1B12(GND) USB-C.B1A12(GND) X1.2(GND)
PVDD: C33.1 C34.2 C35.2 C36.2 C37.2 C38.1 C39.1 C40.2 C41.1 U5.16(LPVDD) U5.27(PVDD) U5.28(PVDD) U5.35(RPVDD)
VBUS: C2.2 D1.2 R3.2 R4.2 U1.3(IN) U1.4(IN) USB-C.A4B9(VBUS) USB-C.B4A9(VBUS)
VDD: C52.2 C53.2 R23.1 U5.8(VDD)
AMP_EN: R20.1 U3.25(PB12)
CC1: R1.1 U3.19(PB1) USB-C.A5(CC1)
CC2: R2.1 U3.18(PB0) USB-C.B5(CC2)
D_OUTL: C22.2 C29.2 R17.2
D_OUTR: C21.1 C28.2 R16.2
DN: D3.2 U3.32(PA11) USB-C.A7(DN1) USB-C.B7(DN2)
DP: D2.2 U3.33(PA12) USB-C.A6(DP1) USB-C.B6(DP2)
I2C_SCL: U3.21(PB10) U6.6
I2C_SDA: U3.26(PB13) U6.7
I2S_CK: R11.1 U3.12(PA2)
I2S_MCK: R10.1 U3.15(PA5)
I2S_SD: R12.1 U3.14(PA4)
I2S_WS: R13.1 U3.11(PA1)
L_OUT_N: C32.2 L5.1 U5.18(LOUTN) U5.19(LFBN)
L_OUT_P: C31.2 L4.1 U5.13(LFBP) U5.14(LOUTP)
MUTE: R14.1 U3.10(PA0)
PLIM: R23.2 U5.11(PLIM)
PUSH: U3.29(PA8) U6.5
R_OUT_N: C43.1 L3.1 U5.32(RFBN) U5.33(ROUTN)
R_OUT_P: C42.2 L2.1 U5.37(ROUTP) U5.38(RFBP)
RST: CN1.10 U3.7(NRST)
SWCLK: CN1.4 U3.37(PA14)
SWDIO: CN1.2 U3.34(PA13)
TRIM_A: U3.28(PB15) U6.4
TRIM_B: U3.27(PB14) U6.3
$1N9692: CN1.9 R9.2
$1N11114: R8.1 SW1.1 U3.44(BOOT0)
$1N19203: C12.2 U3.46(VCAP)
$1N19255: C10.2 U3.22(VCAP)
$1N22344: R7.1 X1.3(OUT)
$1N22347: R7.2 U3.17(PA7)
$2N860: R4.1 R5.2 U1.2(EN/UVLO)
$2N864: C1.1 U1.1(dVdt)
$2N869: R6.2 U1.7(ILM)
$2N871: LED1.1(K) U1.6(FLT#)
$2N874: LED1.2(A) R3.1
$3N915: R11.2 U4.13(BCK)
$3N918: R12.2 U4.14(DIN)
$3N921: R13.2 U4.15(LRCK)
$3N930: R14.2 R15.2 U4.17(XSMT)
$3N957: C23.2 U4.5(VNEG)
$3N959: C24.1 U4.2(CAPP)
$3N963: C24.2 U4.4(CAPM)
$3N970: R16.1 U4.7(OUTR)
$3N973: R17.1 U4.6(OUTL)
$3N989: C15.2 C16.2 U4.18(LDOO)
$3N1715: C54.2 C55.2 C56.2 CN2.1 CN2.2 L2.2
$3N1719: C56.1 C57.2 C58.2 CN3.1 CN3.2 L3.2
$3N1964: C27.1 U5.3(RINP)
$3N1968: C30.1 U5.6(LINP)
$3N2047: C28.1 U5.4(RINN)
$3N2053: C29.1 U5.5(LINN)
$3N2247: LED2.2(A) R18.1
$3N2254: LED2.1(K) U5.1(FLT)
$3N2795: C47.2 R22.2
$3N2805: C47.1 C48.2 L1.1 U5.24(SW) U5.25(SW)
$3N2916: C48.1 U5.26(BST)
$3N4017: C31.1 U5.15(LBSTP)
$3N4137: C32.1 U5.17(LBSTN)
$3N4244: C42.1 U5.36(RBSTP)
$3N4280: C43.2 U5.34(RBSTN)
$3N4548: R21.2 U5.7(SSM)
$3N5926: C59.2 C60.2 C64.2 CN4.1 CN4.2 L4.2
$3N5932: C62.2 C63.2 C64.1 CN5.1 CN5.2 L5.2
$3N8324: R19.1 R20.2 U5.2(EN)
$3N33548: R10.2 U4.12(SCK)

Not connected (* = marked no-connect by the designer): CN1 6 7 8; U2 4(NC); U3 2(PC13) 3(PC14-OSC32_IN) 4(PC15-OSC32_OUT) 5(PH0-OSC_IN) 6(PH1-OSC_OUT) 13(PA3) 16(PA6) 20(PB2) 30(PA9) 31(PA10) 38(PA15) 39(PB3) 40(PB4) 41(PB5) 42(PB6) 43(PB7) 45(PB8); USB-C A8(SBU1) B8(SBU2)

## Notes on the sheets
sheet 1
- MCU
- SWD Headers
- I2C Display & Controls
- © 2026 Elia Chiarucci
  CERN-OHL-S v2 | https://ohwr.org/cern_ohl_s_v2.txt
  Source: https://github.com/eliachiarucci/DA15
sheet 2
- USB-C Port
- VBUS eFuse
- TPS259531 clamps
  output to 5.7V max
- 4.0V - 5.7V range
- UVLO(Low Voltage Cutoff): V_UV = ((R1 + R2) / R2) × V_UVLO(R) =
  ((1000000 + 430000) / 430000) × 1.2 = 3.99V
- I_LIMIT = (2000 / R_ILM) + 0.04 =
  (2000 / 620) + 0.04 = 3.27A
- LDO eFuse to 3.3V
- © 2026 Elia Chiarucci
  CERN-OHL-S v2 | https://ohwr.org/cern_ohl_s_v2.txt
  Source: https://github.com/eliachiarucci/DA15
sheet 3
- DAC
- AMP
- AMP FILTERS AND TERMINALS
- © 2026 Elia Chiarucci
  CERN-OHL-S v2 | https://ohwr.org/cern_ohl_s_v2.txt
  Source: https://github.com/eliachiarucci/DA15
